# EAGLE design Mic_Preamp (EAGLE 8.2.2)
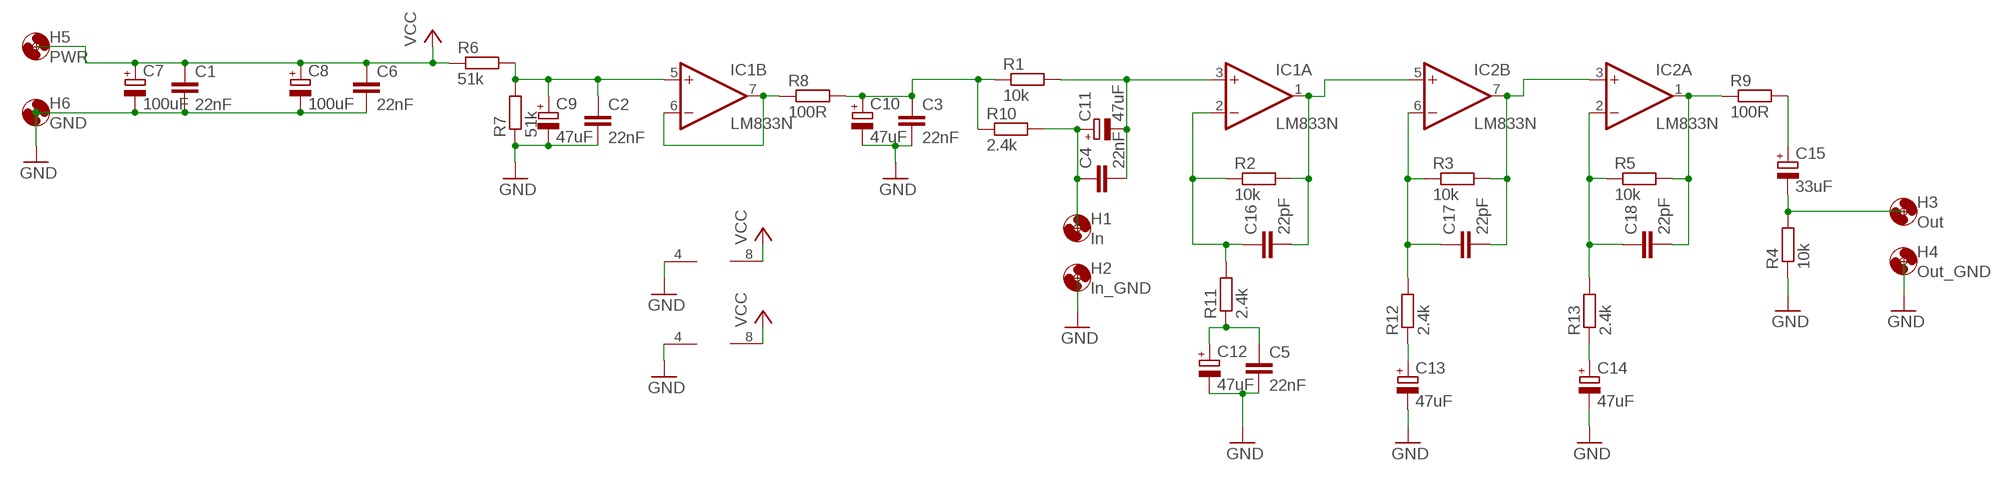
[diagram p0: schematic, sheet 1]

## Parts
C1  22nF  C-EU050-025X075  [C050-025X075]
C2  22nF  C-EU050-025X075  [C050-025X075]
C3  22nF  C-EU050-025X075  [C050-025X075]
C4  22nF  C-EU050-025X075  [C050-025X075]
C5  22nF  C-EU050-025X075  [C050-025X075]
C6  22nF  C-EU050-025X075  [C050-025X075]
C7  100uF  CPOL-EUC/6032-28R  [C/6032-28R]
C8  100uF  CPOL-EUC/6032-28R  [C/6032-28R]
C9  47uF  CPOL-EUE2.5-5  [E2,5-5]
C10  47uF  CPOL-EUE2.5-5  [E2,5-5]
C11  47uF  CPOL-EUE2.5-5  [E2,5-5]
C12  47uF  CPOL-EUE2.5-5  [E2,5-5]
C13  47uF  CPOL-EUE2.5-5  [E2,5-5]
C14  47uF  CPOL-EUE2.5-5  [E2,5-5]
C15  33uF  CPOL-EUE2.5-5  [E2,5-5]
C16  22pF  C-EUC0603K  [C0603K]
C17  22pF  C-EUC0603K  [C0603K]
C18  22pF  C-EUC0603K  [C0603K]
H1  In  MOUNT-HOLE3.0  [3,0]
H2  In_GND  MOUNT-HOLE3.0  [3,0]
H3  Out  MOUNT-HOLE3.0  [3,0]
H4  Out_GND  MOUNT-HOLE3.0  [3,0]
H5  PWR  MOUNT-HOLE3.0  [3,0]
H6  GND  MOUNT-HOLE3.0  [3,0]
IC1  LM833N  [DIL08]
IC2  LM833N  [DIL08]
R1  10k  R-EU_R0805  [R0805]
R2  10k  R-EU_R0805  [R0805]
R3  10k  R-EU_R0805  [R0805]
R4  10k  R-EU_R0805  [R0805]
R5  10k  R-EU_R0805  [R0805]
R6  51k  R-EU_R0805  [R0805]
R7  51k  R-EU_R0805  [R0805]
R8  100R  R-EU_R0805  [R0805]
R9  100R  R-EU_R0805  [R0805]
R10  2.4k  R-EU_R0805  [R0805]
R11  2.4k  R-EU_R0805  [R0805]
R12  2.4k  R-EU_R0805  [R0805]
R13  2.4k  R-EU_R0805  [R0805]

## Nets
GND: C1.2 C2.2 C3.2 C5.2 C6.2 C7.- C8.- C9.- C10.- C12.- C13.- C14.- H2.P$1 H4.P$1 H6.P$1 IC1.4(P:V-) IC2.4(P:V-) R4.1 R7.1
N$1: C2.1 C9.+ IC1.5(B:+IN) R6.2 R7.2
N$4: IC1.6(B:-IN) IC1.7(B:OUT) R8.1
N$5: C3.1 C10.+ R1.1 R8.2 R10.1
N$6: C4.2 C11.- IC1.3(A:+IN) R1.2
N$8: C4.1 C11.+ H1.P$1 R10.2
N$9: C16.2 IC1.1(A:OUT) IC2.5(B:+IN) R2.2
N$10: C16.1 IC1.2(A:-IN) R2.1 R11.2
N$11: C5.1 C12.+ R11.1
N$12: C17.1 IC2.6(B:-IN) R3.1 R12.2
N$13: C17.2 IC2.3(A:+IN) IC2.7(B:OUT) R3.2
N$14: C13.+ R12.1
N$16: C18.1 IC2.2(A:-IN) R5.1 R13.2
N$17: C18.2 IC2.1(A:OUT) R5.2 R9.1
N$18: C14.+ R13.1
N$19: C15.+ R9.2
N$20: C15.- H3.P$1 R4.2
VCC: C1.1 C6.1 C7.+ C8.+ H5.P$1 IC1.8(P:V+) IC2.8(P:V+) R6.1

## Library data of the parts
C1-C6 C16-C18 = rcl:C-EU: CAPACITOR, European symbol
C7-C15 = rcl:CPOL-EU: POLARIZED CAPACITOR, European symbol
H1-H6 = holes:MOUNT-HOLE: MOUNTING HOLE with drill center marker
IC1 IC2 = linear:LM833: OP AMP
R1-R13 = rcl:R-EU_: RESISTOR, European symbol

## Board
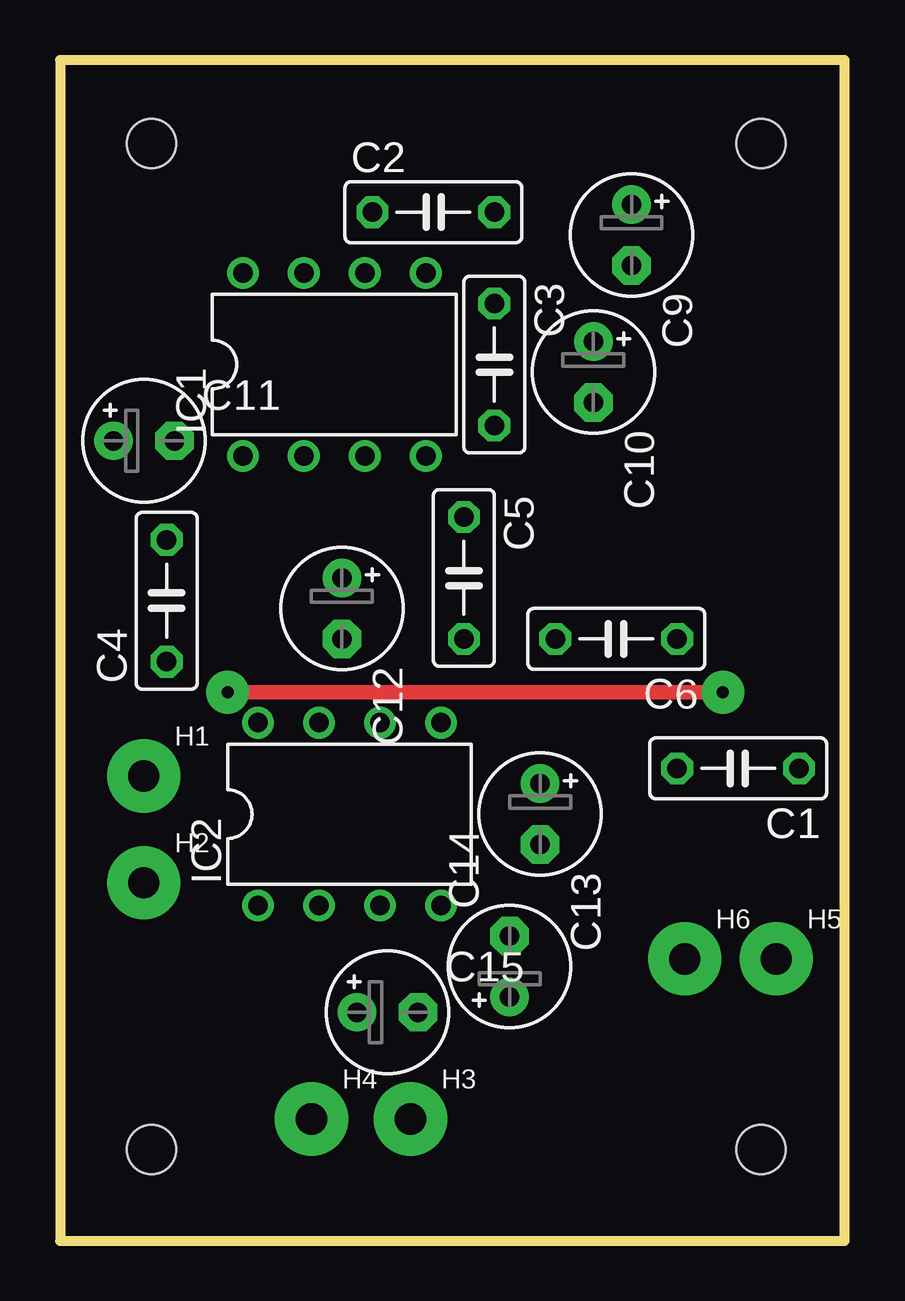
[diagram p1: board, top side]
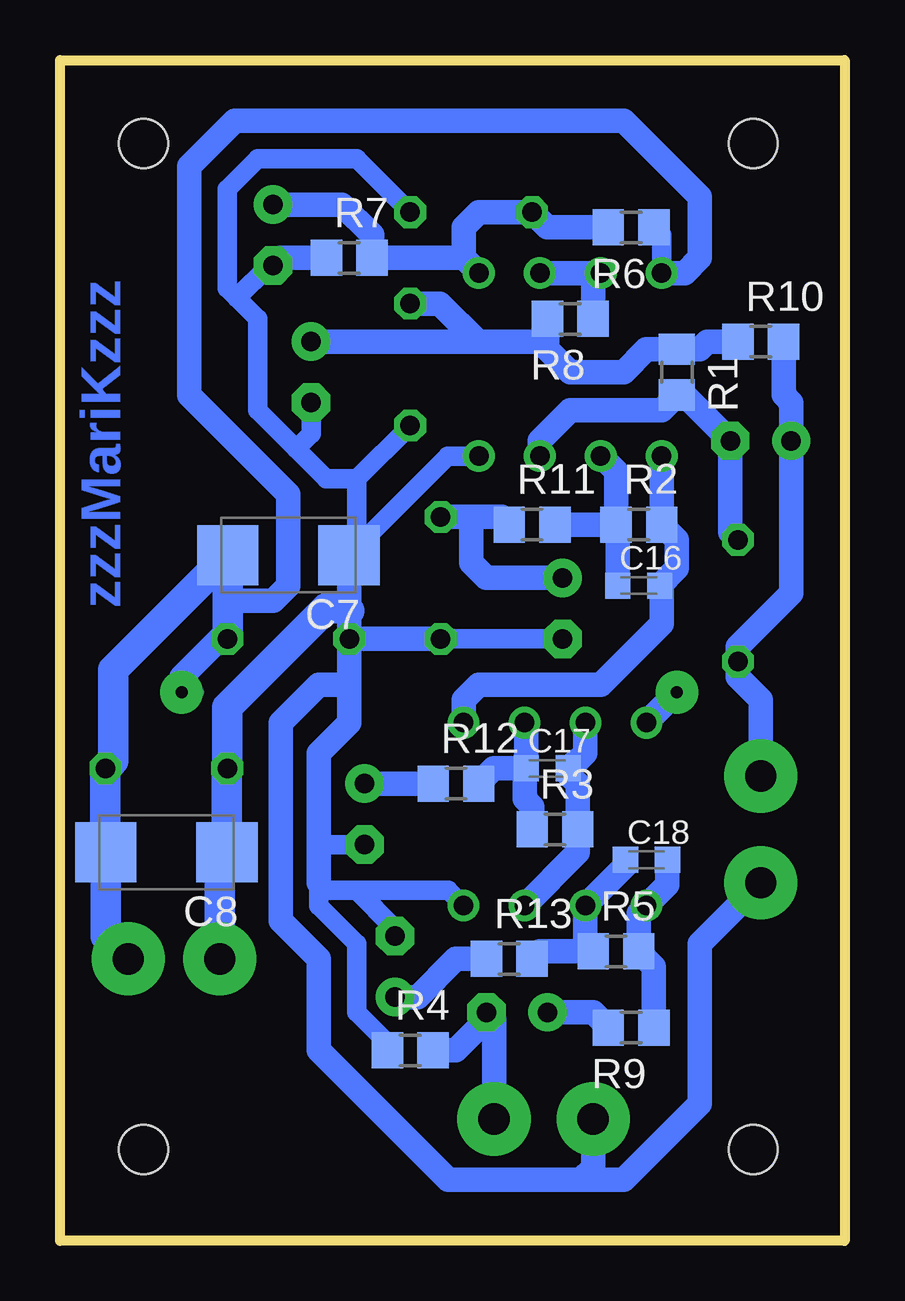
[diagram p2: board, bottom side, seen from below]

Size 32.69 x 49.2 mm. Coordinates in mm from the lower left corner, seen from the top.
Outline: 0,0 32.69,0 32.69,49.2 0,49.2 0,0
Copper layers (1*16): Top 0.035mm / dielectric 1.5mm / Bottom 0.035mm
Design rules "My": minimum track width 16mil, minimum drill 0.35mm, track to track 12mil, track to pad 12mil, pad to pad 12mil, via to via 12mil, smd to smd 12mil, copper to edge 40mil, drill to drill 24mil, minimum pad ring 10mil, minimum via ring 8mil, stop-mask expansion 4mil, vias tented up to drill 0mil, thermal gap 10mil
Holes 2.03 mm at 3.81,45.72 29.21,45.72 3.81,3.81 29.21,3.81

### Footprints (pad centres in the part's own frame; a part is rotated, then mirrored left to right if it is on the bottom)
C050-025X075 = drill 0.813 octagon: 1 -2.54,0; 2 2.54,0
C/6032-28R = smd 2.55 x 2.5: + 2.525,0; - -2.525,0
E2,5-5 = drill 0.813 pad 1.6: + -1.27,0 | drill 0.813 pad 1.6 octagon: - 1.27,0
C0603K = smd 1.05 x 1.08: 1 -0.875,0; 2 0.875,0
3,0 = drill 1.3 pad 3.048: P$1 0,0
DIL08 = drill 0.813 pad 1.27: 1 -3.81,-3.81; 2 -1.27,-3.81; 3 1.27,-3.81; 4 3.81,-3.81; 5 3.81,3.81; 6 1.27,3.81; 7 -1.27,3.81; 8 -3.81,3.81
R0805 = smd 1.3 x 1.5: 1 -0.95,0; 2 0.95,0

### Placement (x,y rotation side)
C1  28.26,19.68 180 top
C2  15.56,42.86 0 top
C3  18.1,36.51 270 top
C4  4.45,26.67 90 top
C5  16.83,27.62 270 top
C6  23.18,25.08 180 top
C7  23.18,28.57 180 bottom
C8  28.26,16.19 180 bottom
C9  23.81,41.91 270 top
C10  22.23,36.2 270 top
C11  3.49,33.34 0 top
C12  11.75,26.35 270 top
C13  20,17.78 270 top
C14  18.73,11.43 90 top
C15  13.65,9.53 0 top
C16  8.57,27.3 0 bottom
C17  12.38,19.68 0 bottom
C18  8.26,15.88 0 bottom
H1  3.49,19.37 0 top
H2  3.49,14.92 0 top
H3  14.61,5.08 0 top
H4  10.48,5.08 0 top
H5  29.84,11.75 0 top
H6  26.04,11.75 0 top
IC1  11.43,36.51 0 top
IC2  12.06,17.78 0 top
R1  6.99,36.2 270 bottom
R2  8.57,29.84 0 bottom
R3  12.06,17.14 0 bottom
R4  18.1,7.94 0 bottom
R5  9.53,12.06 0 bottom
R6  8.89,42.23 180 bottom
R7  20.64,40.96 0 bottom
R8  11.43,38.42 180 bottom
R9  8.89,8.89 180 bottom
R10  3.49,37.47 0 bottom
R11  13.02,29.84 0 bottom
R12  16.19,19.05 0 bottom
R13  13.97,11.75 0 bottom

### Tracks (layer width: path | path; a pad name or v marks a point on that pad's centre or on a via)
GND
  Bottom 0.61: 19.37,7.94 R4.1 | C7.- 20.65,28.29
  Bottom 0.813: 20.32,14.61 21.59,14.61 21.91,14.92 21.91,13.97 20.32,12.38 20.32,9.53 19.05,8.25 R4.1 | 20.32,14.61 16.51,14.61 IC2.4 | C14.- 18.73,13.02 20.32,14.61 | C13.- 21.64,16.51 21.91,16.24 | C5.2 C12.- | IC1.4 16.52,32.7 20.29,28.94 | 20.29,28.94 C7.- | C3.2 20.32,31.75 | 20.32,31.75 20.32,28.96 20.29,28.94 | 20.32,31.75 21.59,31.75 22.85,33.01 | 22.85,33.01 24.45,34.61 24.45,38.42 25.32,39.29 | C10.- 22.23,33.64 22.85,33.01 | 25.32,39.29 25.72,39.69 25.72,43.81 24.45,45.09 20.32,45.09 C2.2 | C9.- 23.96,40.64 25.32,39.29
  Bottom 1.016: 21.91,14.92 21.91,16.24 21.91,20.32 20.64,21.59 20.64,23.38 | 20.65,28.29 20.64,28.27 20.64,26.24 C6.2 | 20.64,23.38 C6.2 | C6.2 C5.2 | 20.64,23.38 20.84,23.18 21.91,23.18 23.5,21.59 23.5,13.34 21.91,11.75 21.91,7.94 16.51,2.54 10.99,2.54 | R7.1 23.5,40.96 C9.- | 10.99,2.54 9.21,2.54 6.03,5.71 6.03,12.38 H2.P$1 | H4.P$1 10.48,3.06 10.99,2.54 | 25.72,16.21 C8.-
  Bottom 1.27: 20.64,26.24 20.75,26.35 21.59,26.35 25.72,22.23 C1.2 25.73,19.67 C8.- 26.04,15.89 H6.P$1
N$1
  Bottom 1.016: 15.88,40.96 IC1.5 | 15.88,40.96 15.88,42.23 15.24,42.86 C2.1 12.38,42.23 R6.2 | 15.88,40.96 R7.2 19.69,41.91 20.95,43.18 C9.+
N$4
  Bottom 1.016: R8.1 10.48,40 IC1.7 IC1.6
N$5
  Bottom 1.016: R10.1 5.71,37.47 6.04,37.15 R1.1 8.26,37.15 9.21,36.2 11.43,36.2 12.38,37.15 | 12.38,37.15 R8.2 | 12.38,37.15 12.7,37.47 15.27,37.47 | 15.27,37.47 C10.+ | C3.1 16.86,39.05 15.27,37.47
N$6
  Bottom 1.016: C4.2 4.76,29.53 C11.- 6.67,35.24 R1.2 7.62,34.61 11.43,34.61 12.7,33.34 IC1.3
N$8
  Bottom 0.61: 2.22,37.15 R10.2
  Bottom 1.016: H1.P$1 3.49,22.54 4.45,23.5 C4.1 4.45,24.77 2.22,26.99 C11.+ 2.22,34.92 2.54,35.24 R10.2
N$9
  Bottom 1.016: IC1.1 R2.2 6.99,29.21 6.99,28.02 C16.2 7.62,27.23 7.62,25.72 10.16,23.18 15.24,23.18 15.88,22.54 IC2.5
N$10
  Bottom 1.016: C16.1 9.45,29.77 R2.1 | R2.1 R11.2 | R2.1 9.52,32.06 IC1.2
N$11
  Bottom 1.016: 15.27,30.16 C5.1 | 15.27,30.16 14.29,30.16 R11.1 | C12.+ 14.92,27.62 15.56,28.26 15.56,29.88 15.27,30.16
N$12
  Bottom 1.016: R3.1 13.02,18.09 13.34,18.41 13.34,19.61 C17.1 | C17.1 13.26,21.51 IC2.6 | C17.1 14.61,19.68 R12.2
N$13
  Bottom 1.016: IC2.3 11.11,16.19 R3.2 11.11,19.05 11.51,19.45 C17.2 11.19,20 11.11,20 10.79,20.32 IC2.7
N$14
  Bottom 1.016: C13.+ R12.1
N$16
  Bottom 1.016: C18.1 9.13,15.63 IC2.2 10.79,12.38 R5.1 12.7,12.06 R13.2
N$17
  Bottom 1.016: R9.1 7.94,11.43 R5.2 8.57,13.65 IC2.1 7.38,14.85 C18.2
N$18
  Bottom 1.016: R13.1 16.19,11.75 17.78,10.16 C14.+
N$19
  Bottom 1.016: C15.+ 10.47,9.53 R9.2
N$20
  Bottom 1.016: R4.2 16.19,7.94 14.92,9.21 C15.- 14.61,9.21 H3.P$1
VCC  (via drill 0.5 pad 1.78)
  Top 0.61: v6.99,22.86 v27.62,22.86
  Bottom 0.61: v27.62,22.86 26.99,22.86
  Bottom 0.813: IC1.8 7.62,41.91 R6.1
  Bottom 1.016: IC2.8 v6.99,22.86 | 25.7,26.67 23.81,26.67 23.18,27.3 23.18,31.11 27.3,35.24 27.3,44.77 25.4,46.67 9.21,46.67 6.03,43.5 6.03,40.96 6.67,40.32 IC1.8 | C6.1 26.04,25.08 27.62,23.5 v27.62,22.86
  Bottom 1.27: C6.1 25.7,25.1 25.7,26.67 C7.+ 30.48,23.8 30.48,20 C1.1 30.8,16.21 C8.+ 30.78,12.69 H5.P$1
(copper drawn outside any net)
  shapes: Bottom circle x4

### Text on the board
Bottom: zzzMariKzzz